# Altium project Nixie_clocks_Controls_board.PrjPcb
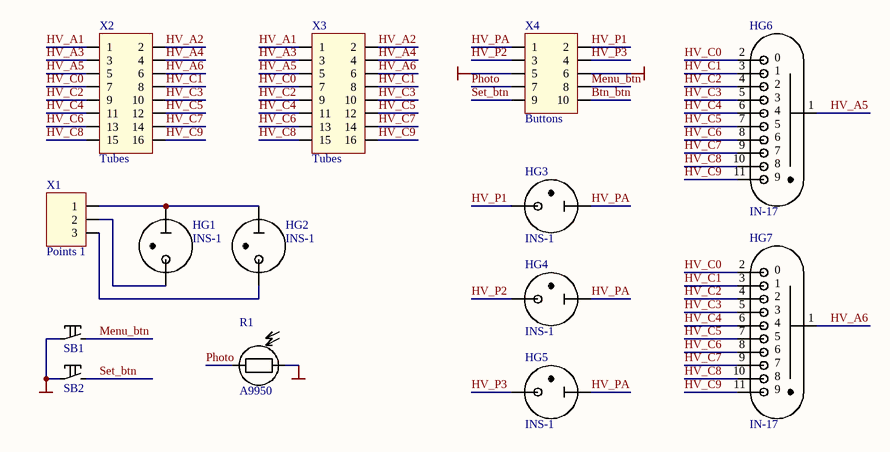
[diagram p0: Nixie_clocks_Controls_board.SchDoc]
1 sheet, 14 parts. Net scope: global (net labels, ports and power ports of the same name join across sheets).
Board file: Nixie_clocks_Controls_board.PcbDoc

## Sheet Nixie_clocks_Controls_board.SchDoc
size A4 portrait

### Parts
HG1  INS-1  [INS-1]
HG2  INS-1  [INS-1]
HG3  INS-1  [INS-1]
HG4  INS-1  [INS-1]
HG5  INS-1  [INS-1]
HG6  IN-17  [IN-17_socket]
HG7  IN-17  [IN-17_socket]
R1  A9950  [A99]
SB1  SPST_button  [TACT-69N-F]  (value not drawn)
SB2  SPST_button  [TACT-69N-F]  (value not drawn)
X1  Points 1  [WF-3]
X2  Tubes  [IDC16]
X3  Tubes  [IDC16]
X4  Buttons  [IDC10]

### Nets
GND: R1.2 SB1.1 SB2.1 X4.5 X4.6
Btn_btn: X4.10
HV_A1: X2.1 X3.1
HV_A2: X2.2 X3.2
HV_A3: X2.3 X3.3
HV_A4: X2.4 X3.4
HV_A5: HG6.1(A) X2.5 X3.5
HV_A6: HG7.1(A) X2.6 X3.6
HV_C0: HG6.2 HG7.2 X2.7 X3.7
HV_C1: HG6.3 HG7.3 X2.8 X3.8
HV_C2: HG6.4 HG7.4 X2.9 X3.9
HV_C3: HG6.5 HG7.5 X2.10 X3.10
HV_C4: HG6.6 HG7.6 X2.11 X3.11
HV_C5: HG6.7 HG7.7 X2.12 X3.12
HV_C6: HG6.8 HG7.8 X2.13 X3.13
HV_C7: HG6.9 HG7.9 X2.14 X3.14
HV_C8: HG6.10 HG7.10 X2.15 X3.15
HV_C9: HG6.11 HG7.11 X2.16 X3.16
HV_P1: HG3.2 X4.2
HV_P2: HG4.2 X4.3
HV_P3: HG5.2 X4.4
HV_PA: HG3.1 HG4.1 HG5.1 X4.1
Menu_btn: SB1.2 X4.8
Photo: R1.1 X4.7
Set_btn: SB2.2 X4.9
NetHG1_1: HG1.1 HG2.1 X1.1
NetHG1_2: HG1.2 X1.2
NetHG2_2: HG2.2 X1.3

### Library data of the parts
HG1-HG5 = INS-1: INS-1 neon lamp verticap PCB mounting; Part Number: INS-1
HG6 HG7 = IN-17: IN-17 PCB nixie tube; Part Number: IN-17
R1 = A9950: THT 5mm photoresistor; Part Number: A9950
SB1 SB2 = TACT-69N-F: Tact Button 6x6mm; Part Number: TACT-69N-F
X1 = WF-3: PCB Connector; Part Number: WF-3
X2 X3 = IDC-16: PCB Connector; Part Number: IDC-16
X4 = IDC-10: PCB Connector; Part Number: IDC-10